# EAGLE design brushed_UAS_Design_2_routed (EAGLE 9.6.2)
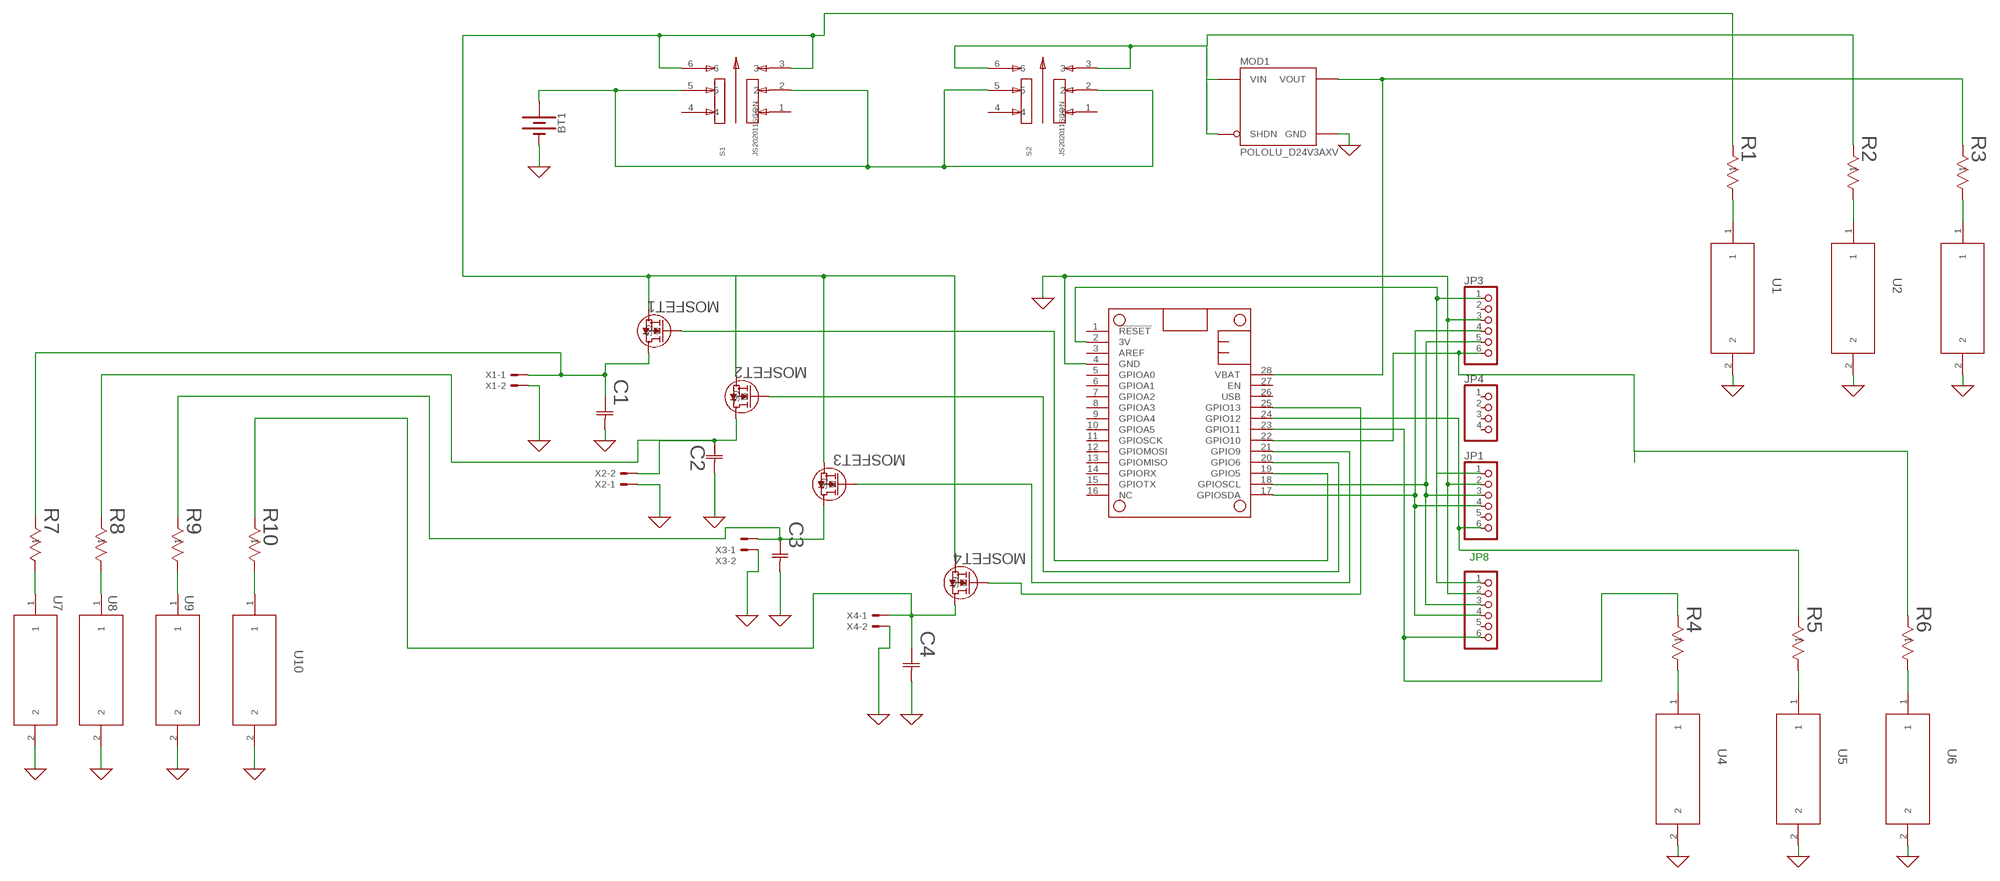
[diagram p0: schematic, sheet 1, part 1 of 2]
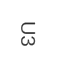
[diagram p1: schematic, sheet 1, part 2 of 2]

## Parts
BT1  BATTERY-18650  [BATTERY_18650-HOLDER]
C1  ECH-U1H102JX5CAP_J1_PAN-M  [CAP_J1_PAN-M]
C2  ECH-U1H102JX5CAP_J1_PAN-M  [CAP_J1_PAN-M]
C3  ECH-U1H102JX5CAP_J1_PAN-M  [CAP_J1_PAN-M]
C4  ECH-U1H102JX5CAP_J1_PAN-M  [CAP_J1_PAN-M]
JP1  HEADER-1X670MIL  [1X06_ROUND_70]
JP3  HEADER-1X676MIL  [1X06_ROUND_76]
JP4  HEADER-1X476MIL  [1X04_ROUND_76]
JP8  HEADER-1X670MIL  [1X06_ROUND_70]
MOD1  POLOLU_D24V3AXV  [POLOLU_D24VXAYV_HC]
MOSFET1  SI2342DS-T1-GE3SOT-23_TO-236_VIS-M  [SOT-23_TO-236_VIS-M]
MOSFET2  SI2342DS-T1-GE3SOT-23_TO-236_VIS-M  [SOT-23_TO-236_VIS-M]
MOSFET3  SI2342DS-T1-GE3SOT-23_TO-236_VIS-M  [SOT-23_TO-236_VIS-M]
MOSFET4  SI2342DS-T1-GE3SOT-23_TO-236_VIS-M  [SOT-23_TO-236_VIS-M]
MS1  FEATHERWING_NODIM  [FEATHERWING_DIM]
R1  CR0805-FX-1000ELFBO_CR0805-M  [BO_CR0805-M]
R2  CR0805-FX-1000ELFBO_CR0805-M  [BO_CR0805-M]
R3  CR0805-FX-1000ELFBO_CR0805-M  [BO_CR0805-M]
R4  CR0805-FX-1000ELFBO_CR0805-M  [BO_CR0805-M]
R5  CR0805-FX-1000ELFBO_CR0805-M  [BO_CR0805-M]
R6  CR0805-FX-1000ELFBO_CR0805-M  [BO_CR0805-M]
R7  CR0805-FX-1000ELFBO_CR0805-M  [BO_CR0805-M]
R8  CR0805-FX-1000ELFBO_CR0805-M  [BO_CR0805-M]
R9  CR0805-FX-1000ELFBO_CR0805-M  [BO_CR0805-M]
R10  CR0805-FX-1000ELFBO_CR0805-M  [BO_CR0805-M]
S1  JS202011SCQN  [SW_JS202011SCQN]
S2  JS202011SCQN  [SW_JS202011SCQN]
U1  L196L-QBCL196L-QBC_AOP-M  [L196L-QBC_AOP-M]
U2  L196L-QBCL196L-QBC_AOP-M  [L196L-QBC_AOP-M]
U3  L196L-QBCL196L-QBC_AOP-M  [L196L-QBC_AOP-M]
U4  L196L-QBCL196L-QBC_AOP-M  [L196L-QBC_AOP-M]
U5  L196L-QBCL196L-QBC_AOP-M  [L196L-QBC_AOP-M]
U6  L196L-QBCL196L-QBC_AOP-M  [L196L-QBC_AOP-M]
U7  L196L-QBCL196L-QBC_AOP-M  [L196L-QBC_AOP-M]
U8  L196L-QBCL196L-QBC_AOP-M  [L196L-QBC_AOP-M]
U9  L196L-QBCL196L-QBC_AOP-M  [L196L-QBC_AOP-M]
U10  L196L-QBCL196L-QBC_AOP-M  [L196L-QBC_AOP-M]
X1  22-23-2021  [22-23-2021]
X2  22-23-2021  [22-23-2021]
X3  22-23-2021  [22-23-2021]
X4  22-23-2021  [22-23-2021]

## Nets
0: BT1.GND@1(-) C1.2 C2.2 C3.2 C4.2 JP1.2 JP3.3 JP8.2 MOD1.G(GND) MS1.4(GND) U1.2 U2.2 U3.2 U4.2 U5.2 U6.2 U7.2 U8.2 U9.2 U10.2 X1.2 X2.1 X3.2 X4.2 ; supply symbol labelled GND
3V: JP1.1 JP3.1 JP8.1 MS1.2(3V)
N$1: BT1.PWR@1(+) S1.2 S1.5 S2.2 S2.5
N$2: MOSFET1.2(S) MOSFET2.2(S) MOSFET3.2(S) MOSFET4.2(S) R1.1 S1.3 S1.6
N$3: R1.2 U1.1
N$4: R2.2 U2.1
N$5: R3.2 U3.1
N$6: MOD1.I(VIN) MOD1.S(SHDN) R2.1 S2.3 S2.6
N$7: MOSFET1.1(G) MS1.19(GPIO5)
N$8: MOSFET2.1(G) MS1.20(GPIO6)
N$9: R4.2 U4.1
N$10: R5.2 U5.1
N$11: R6.2 U6.1
N$12: MOSFET4.1(G) MS1.25(GPIO13)
N$13: MOSFET3.1(G) MS1.21(GPIO9)
N$14: JP1.4 JP3.4 JP8.4 MS1.17(GPIOSDA)
N$15: C4.1 MOSFET4.3(D) R10.1 X4.1
N$16: JP8.6 MS1.23(GPIO11) R4.1
N$17: R10.2 U10.1
N$18: R9.2 U9.1
N$19: R8.2 U8.1
N$20: R7.2 U7.1
N$21: JP1.3 JP3.5 JP8.3 MS1.18(GPIOSCL)
N$22: C3.1 MOSFET3.3(D) R9.1 X3.1
N$23: C1.1 MOSFET1.3(D) R7.1 X1.1
N$24: C2.1 MOSFET2.3(D) R8.1 X2.2
N$25: JP1.6 MS1.24(GPIO12) R5.1
N$26: JP3.6 MS1.22(GPIO10) R6.1
VBAT: MOD1.O(VOUT) MS1.28(VBAT) R3.1
Unconnected: JP1.5 JP3.2 JP4.1 JP4.2 JP4.3 JP4.4 JP8.5 MS1.1(!RESET) MS1.3(AREF) MS1.5(GPIOA0) MS1.6(GPIOA1) MS1.7(GPIOA2) MS1.8(GPIOA3) MS1.9(GPIOA4) MS1.10(GPIOA5) MS1.11(GPIOSCK) MS1.12(GPIOMOSI) MS1.13(GPIOMISO) MS1.14(GPIORX) MS1.15(GPIOTX) MS1.16(NC) MS1.26(USB) MS1.27(EN) S1.1 S1.4 S2.1 S2.4

## Notes on the sheet
- JP8

## Library data of the parts
BT1 = SparkFun-Batteries:BATTERY: Battery - Single Cell A variety of battery chemistries, sizes, and footprints. Device List: 20MM_PTH - Coin Cell Battery Holder - 20mm (PTH) <https://www.sparkfun.com/products/783> 6.8MM_PTH - Coin Cell Battery Holder - 6.8MM(SMD) <https://www.digikey.com/product-detail/en/seiko-instruments/MS621FE-FL11E/728-1057-ND/1889208?WT.srch=1&gclid=CNOQ5a6LzdQCFZS2wAodXCkE0g> 12MM_SMD - Coin Cell Battery Holder - 12mm (SMD) <https://www.sparkfun.com/products/10592> 12MM_PTH - Coin Cell Battery Holder - 12mm (PTH) <https://www.sparkfun.com/products/7948> 20MM_SMD - 20mm Coin Cell Battery Holder (SMD) (2 legs) Used on the Big Time Watch Kit <https://www.sparkfun.com/products/11734> 20MM_SMD_4LEGS - Coin Cell Battery Holder - 20mm (SMD) <https://www.sparkfun.com/products/11892> 20MM_SMD_4LEGS_OVERPASTE - Coin Cell Battery Holder - 20mm (SMD) <https://www.sparkfun.com/products/11892> (Over-paste on the legs) 24.5MM_PTH - Coin Cell Battery Holder - 24.5mm (PTH) <https://www.sparkfun.com/products/8863> 9V - 9V Battery Holder - PC Mount Used on the SparkFun SparkPunk Sound Kit <https://www.sparkfun.com/products/11177> and SparkFun SparkPunk Sequencer Kit <https://www.sparkfun.com/products/12707> 18650 - Battery Holder - 18650 (PTH) <https://www.sparkfun.com/products/13113> AA - Battery Holder - 1xAA (PTH) <https://www.sparkfun.com/products/7949> AAA - Battery Holder - 1xAAA (PTH) <https://www.sparkfun.com/products/12718> AA_KIT - Battery Holder - 1xAA (PTH) <https://www.sparkfun.com/products/7949> Special kit package - pads only have exposed copper on one side of the board. AAA_KIT - Battery Holder - 1xAAA (PTH) <https://www.sparkfun.com/products/12718> Special kit package - pads only have exposed copper on one side of the board.; PROD_ID: BATT-12327; SF_SKU: PRT-13113
C1-C4 = UAS_Capacitor:ECH-U1H102JX5; BUILT_BY: EMA_UL_Team; MANUFACTURER_PART_NUMBER: ECH-U1H102JX5; SOURCELIBRARY: Panasonic_2014-06-20; VENDOR: Panasonic
JP1 JP3 JP8 = microbuilder:HEADER-1X6: PIN HEADER
JP4 = microbuilder:HEADER-1X4: PIN HEADER
MOD1 = _hhn_Pololu:POLOLU_D24V3A*V: Pololu Adjustable Step Down Voltage Regulators Series D24V3A_V (300 mA) 0.4"x0.6" SOURCE www.pololu.com/ PACKAGE THT; 4-pin (0.1"); 0.4"x0.6" TECHNOLOGIES D24V3A…V Vi = (4.5…42)V Vo/V (Vo < Vi) X: (generic) L: (2.5… 7.5) H: (4.0…25.0) Io: 300 mA; Quiescent Current: 2 mA (SHDN: 20 uA) Author: Dipl.-Ing. FH Rainer Bayer
MOSFET1-MOSFET4 = Import1:SI2342DS-T1-GE3; BUILT_BY: EMA_Cory; COPYRIGHT: Copyright (C) 2018 Accelerated Designs. All rights reserved; DATASHEET: http://www.vishay.com/docs/63302/si2342ds.pdf; MANUFACTURER_PART_NUMBER: SI2342DS-T1-GE3; SOURCELIBRARY: Vishay_2020-03-16; VENDOR: Vishay
MS1 = adafruit:FEATHERWING
R1-R10 = 100_Ohm_Resistor:CR0805-FX-1000ELF; BUILT_BY: EMA_UL_Team; MANUFACTURER_PART_NUMBER: CR0805-FX-1000ELF; SOURCELIBRARY: Bourns_2014-12-31; VENDOR: Bourns Electronics
S1 S2 = JS202011SCQN:JS202011SCQN: JS Series DPDT On-On Gull Wing Surface Mount Subminiature Slide Switch; DESCRIPTION: Slide Switch DPDT Surface Mount; DIGI-KEY_PART_NUMBER: 401-2002-1-ND; MF: C&K; MP: JS202011SCQN; PACKAGE: None; PURCHASE-URL: https://pricing.snapeda.com/search/part/JS202011SCQN/?ref=eda
U1-U10 = UAS_LED:L196L-QBC; BUILT_BY: EMA_Colton; COPYRIGHT: Copyright (C) 2018 Accelerated Designs. All rights reserved; DATASHEET: https://www.aopled.com/AOP_PDFs/L196L-QBC.pdf; MANUFACTURER_PART_NUMBER: L196L-QBC; SOURCELIBRARY: Add_to_database_2020-12-29; VENDOR: American Opto Plus
X1-X4 = con-molex:22-23-2021: .100" (2.54mm) Center Header - 2 Pin; MF: MOLEX; MPN: 22-23-2021; OC_FARNELL: 1462926; OC_NEWARK: 25C3832

## Board
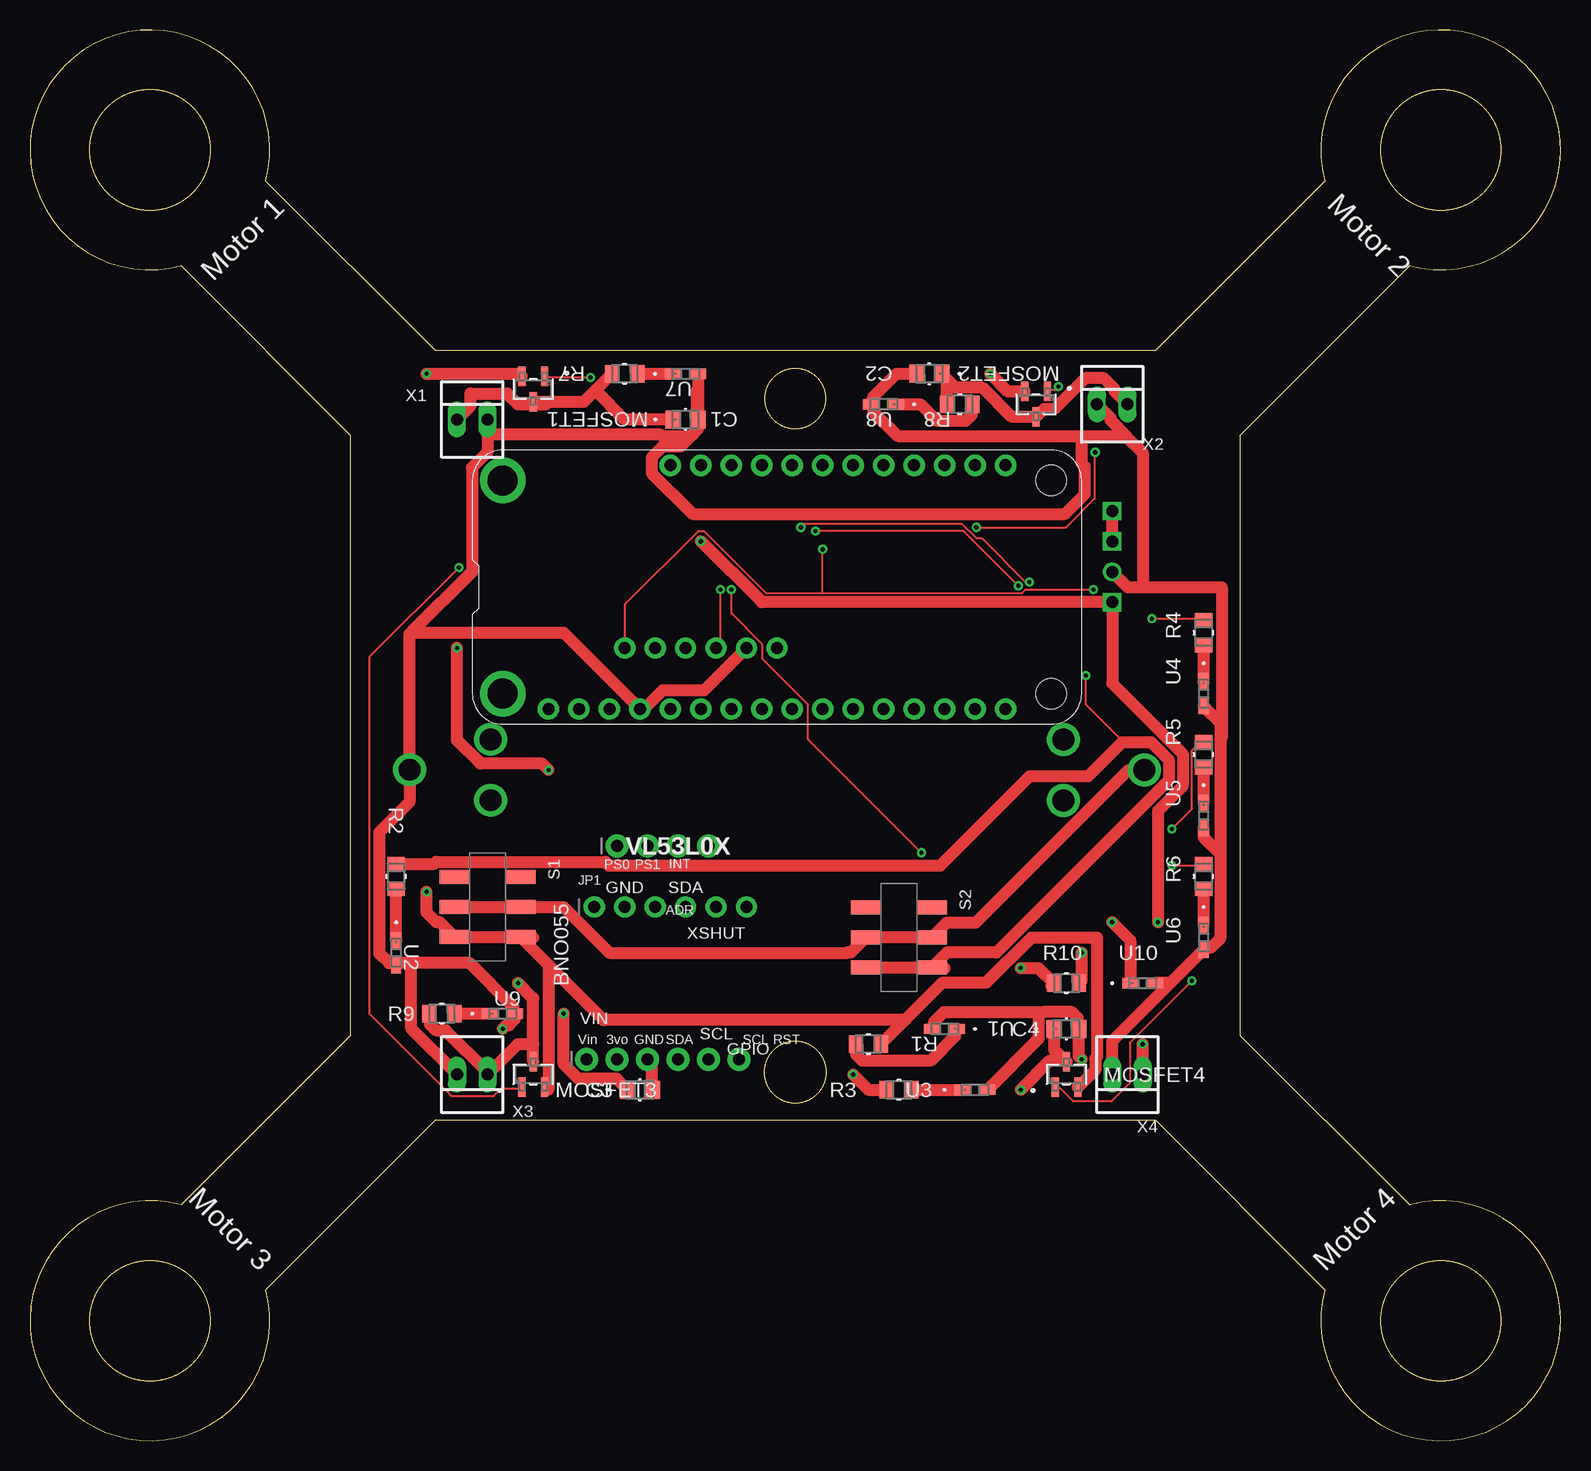
[diagram p2: board, top side]
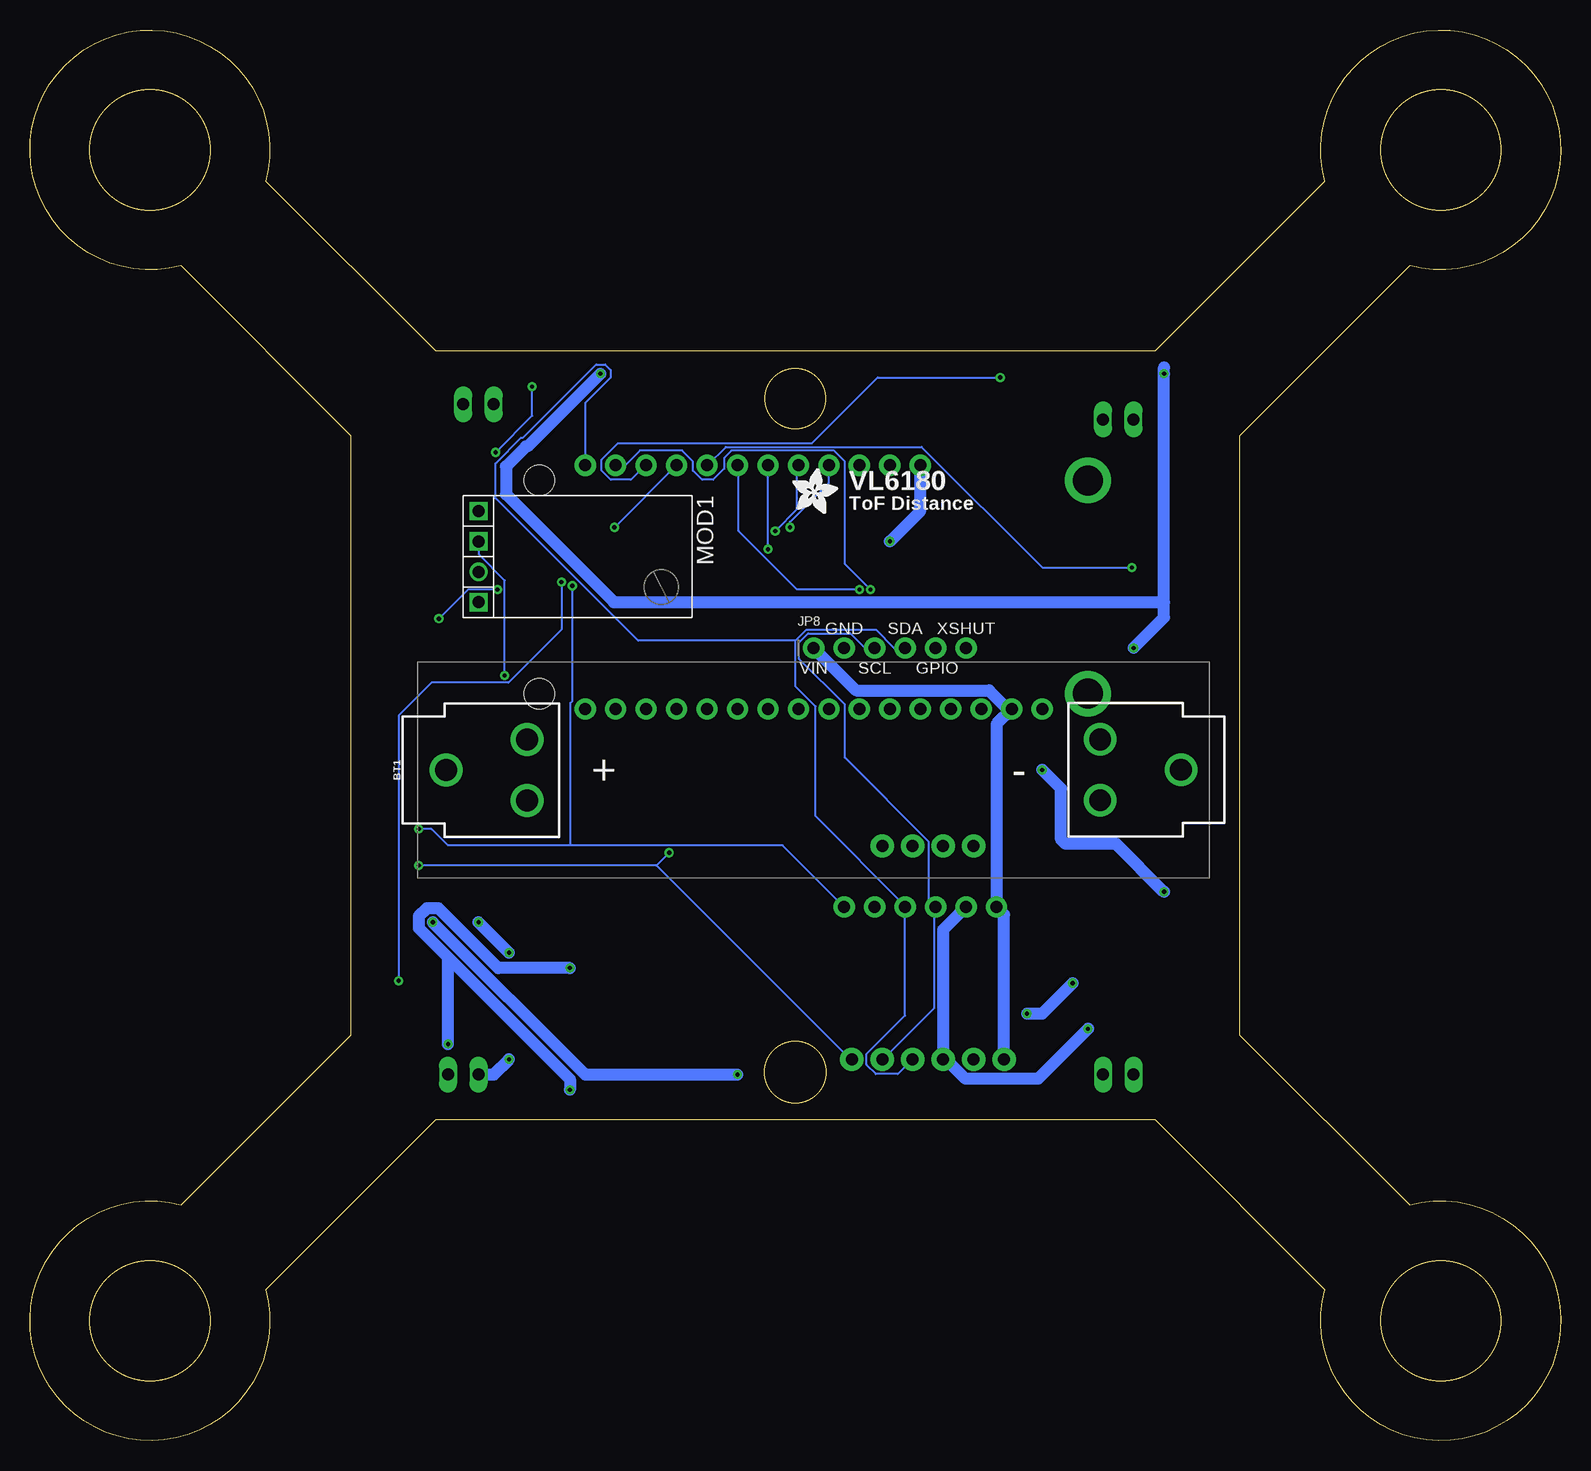
[diagram p3: board, bottom side, seen from below]

Size 127.6 x 117.6 mm. Coordinates in mm from the lower left corner, seen from the top.
Outline: 100.87,83.8 115.01,97.94 arc300 107.94,105.01 93.8,90.87 33.8,90.87 19.66,105.01 arc300 12.59,97.94 26.73,83.8 26.73,33.8 12.59,19.66 arc300 19.66,12.59 33.8,26.73 93.8,26.73 107.94,12.59 arc300 115.01,19.66 100.87,33.8 100.87,83.8
Outline: circle at 117.6,107.6 radius 5
Outline: circle at 117.6,10 radius 5
Outline: circle at 63.8,30.73 radius 2.55
Outline: circle at 10,10 radius 5
Outline: circle at 63.8,86.87 radius 2.5
Outline: circle at 10,107.6 radius 5
Copper layers (1*16): Top 0.035mm / dielectric 1.5mm / Bottom 0.035mm
Design rules "default": minimum track width 6mil, minimum drill 0.35mm, track to track 6mil, track to pad 6mil, pad to pad 6mil, via to via 6mil, smd to smd 6mil, copper to edge 40mil, drill to drill 6mil, minimum pad ring 10mil, minimum via ring 8mil, stop-mask expansion 4mil, vias tented up to drill 0mil, thermal gap 10mil

### Footprints (pad centres in the part's own frame; a part is rotated, then mirrored left to right if it is on the bottom)
BATTERY_18650-HOLDER = drill 1.829: GND@1 30.628,0.01; GND@2 23.88,2.55; GND@3 23.88,-2.53; PWR@1 -30.628,-0.01; PWR@2 -23.88,2.53; PWR@3 -23.88,-2.55
CAP_J1_PAN-M = smd 1.27 x 1.499: 1 -1.029,0; 2 1.029,0
1X06_ROUND_70 = drill 1 pad 1.778: 1 -6.35,0; 2 -3.81,0; 3 -1.27,0; 4 1.27,0; 5 3.81,0; 6 6.35,0
1X06_ROUND_76 = drill 1 pad 1.93: 1 -6.35,0; 2 -3.81,0; 3 -1.27,0; 4 1.27,0; 5 3.81,0; 6 6.35,0
1X04_ROUND_76 = drill 1 pad 1.93: 1 -3.81,0; 2 -1.27,0; 3 1.27,0; 4 3.81,0
POLOLU_D24VXAYV_HC = drill 1: G 1.27,-8.89 | drill 1 square: I -1.27,-8.89; O 3.81,-8.89; S -3.81,-8.89
SOT-23_TO-236_VIS-M = smd 0.61 x 1.626: 1 -0.95,-1.067; 2 0.95,-1.067; 3 0,1.067
FEATHERWING_DIM = drill 1 pad 1.778: 1 6.35,1.27; 2 8.89,1.27; 3 11.43,1.27; 4 13.97,1.27; 5 16.51,1.27; 6 19.05,1.27; 7 21.59,1.27; 8 24.13,1.27; 9 26.67,1.27; 10 29.21,1.27; 11 31.75,1.27; 12 34.29,1.27; 13 36.83,1.27; 14 39.37,1.27; 15 41.91,1.27; 16 44.45,1.27; 17 44.45,21.59; 18 41.91,21.59; 19 39.37,21.59; 20 36.83,21.59; 21 34.29,21.59; 22 31.75,21.59; 23 29.21,21.59; 24 26.67,21.59; 25 24.13,21.59; 26 21.59,21.59; 27 19.05,21.59; 28 16.51,21.59 | drill 2.5 pad 3.81: P$1 2.54,20.32; P$2 2.54,2.54 | hole 2.54: 48.26,20.32; 48.26,2.54
BO_CR0805-M = smd 1.168 x 1.448: 1 -1.054,0; 2 1.054,0
SW_JS202011SCQN = smd 1.2 x 2.5: 1 -2.5,-2.75; 2 0,-2.75; 3 2.5,-2.75; 4 -2.5,2.75; 5 0,2.75; 6 2.5,2.75
L196L-QBC_AOP-M = smd 1.372 x 0.864: 1 -1.023,0; 2 1.023,0
22-23-2021 = drill 1 long: 1 -1.27,0; 2 1.27,0

### Placement (x,y rotation side)
BT1  62.27,55.92 0 bottom
C1  54.65,85.13 0 top
C2  74.97,88.94 180 top
C3  50.84,29.25 0 top
C4  86.4,34.33 0 top
JP1  53.38,44.49 0 top
JP3  52.75,31.79 0 top
JP4  52.75,49.57 0 top
JP8  55.92,66.08 0 bottom
MOD1  81.32,73.7 270 bottom
MOSFET1  41.95,87.67 180 top
MOSFET2  83.86,86.4 180 top
MOSFET3  41.95,30.52 0 top
MOSFET4  86.4,30.52 0 top
MS1  36.87,59.73 0 top
R1  69.89,33.06 180 top
R2  30.52,47.03 270 top
R3  72.43,29.25 0 top
R4  97.83,67.35 270 top
R5  97.83,57.19 270 top
R6  97.83,47.03 270 top
R7  49.57,88.94 0 top
R8  77.51,86.4 0 top
R9  34.33,35.6 0 top
R10  86.4,38.14 0 top
S1  38.14,44.49 270 top
S2  72.43,41.95 270 top
U1  76.24,34.33 180 top
U2  30.52,40.68 270 top
U3  78.78,29.25 0 top
U4  97.83,62.27 270 top
U5  97.83,52.11 270 top
U6  97.83,41.95 270 top
U7  54.65,88.94 0 top
U8  71.16,86.4 180 top
U9  39.41,35.6 0 top
U10  92.75,38.14 0 top
U$19  [ADAFRUIT_3.5MM]  64.05,77.26 0 bottom
X1  36.87,85.13 0 top
X2  90.21,86.4 0 top
X3  36.87,30.52 180 top
X4  91.48,30.52 180 top

### Tracks (layer width: path | path; a pad name or v marks a point on that pad's centre or on a via)
0  (via drill 0.35)
  Top 1.016: U2.2 30.37,39.81 | 30.37,39.81 29.92,39.81 29.14,40.6 29.14,50.73 31.64,53.23 BT1.GND@1 31.64,67.2 31.79,67.35 | C3.2 51.87,31.4 JP3.3 | 31.79,39.81 36.67,39.81 40.28,36.2 40.28,35.75 U9.2 40.43,35.16 39.94,34.66 39.74,34.66 v39.41,34.33 | 31.79,39.81 30.37,39.81 | X3.2 31.79,34.33 31.79,39.81 | 84.46,35.74 84.08,35.35 84.08,33.52 U3.2 | 84.46,35.74 86.83,35.74 87.33,35.25 87.33,34.43 C4.2 87.43,32.03 v87.67,31.79 | U1.2 75.37,34.48 75.37,34.93 76.18,35.74 84.46,35.74 | 95.04,38.14 U6.2 97.98,41.08 98.43,41.08 99.22,41.87 99.22,48.94 | 95.04,38.14 U10.2 | U5.2 97.83,50.33 99.22,48.94 | U4.2 99.22,59.86 99.22,58.46 | 99.22,58.46 99.22,48.94 | MOD1.G 91.48,71.16 92.75,71.16 | 92.75,71.16 99.35,71.16 99.35,58.59 99.22,58.46 | 31.79,67.35 44.49,67.35 MS1.4 51.19,61 52.74,62.55 56.2,62.55 JP8.2 | X1.2 38.14,83.86 | 38.14,83.86 38.14,82.41 36.85,81.11 36.85,72.41 31.79,67.35 | U7.2 55.68,87.67 | 55.68,87.67 C1.2 55.68,84.32 54.23,82.87 52.74,82.87 51.83,81.96 51.83,80.68 55.25,77.26 86.29,77.26 87.93,78.89 87.93,81.21 87.67,81.46 87.67,83.75 | 55.68,87.67 55.58,87.57 55.58,84.22 55.08,83.72 52.71,83.72 52.57,83.86 38.14,83.86 | X2.1 90.07,85.28 90.07,85.06 91.37,83.75 | 92.75,71.16 92.75,82.38 91.37,83.75 | C2.2 72.23,88.94 70.29,87 70.29,86.55 U8.2 70.29,86.25 70.29,85.8 72.34,83.75 87.67,83.75 | 87.67,83.75 91.37,83.75 | X4.2 90.21,33.31 95.04,38.14
  Bottom 1.016: JP1.2 51.48,42.59 JP3.3 51.24,31.79 49.61,30.17 43.58,30.17 v39.41,34.33 | X4.2 88.94,30.52 v87.67,31.79
3V
  Bottom 1.016: JP8.1 58.74,62.55 47.66,62.55 46.11,61 MS1.2 47.03,59.73 JP1.1 46.4,43.86 JP3.1
N$1
  Top 0.152: S1.5 40.94,44.44 40.94,44.49
  Top 1.016: S1.2 S1.5 40.94,44.49 44.49,44.49 48.3,40.68 68.13,40.68 68.16,40.71 68.44,40.71 S2.2 S2.5 76.42,43.19 78.84,43.19 91.57,55.91 BT1.PWR@1
N$2  (via drill 0.35)
  Top 0.152: MOSFET3.2 42.92,29.51 43.22,29.51
  Top 1.016: S1.6 S1.3 34.15,43.23 33.87,43.23 33.06,44.04 v33.06,45.76 | S1.6 41.91,41.99 41.95,41.95 40.93,41.95 S1.6 | S1.6 43.22,39.66 | 43.22,39.66 43.22,29.51 43.22,29.25 | R1.1 72.96,35.07 | 72.96,35.07 76.08,38.19 79.71,38.19 83.47,41.95 88.94,41.95 88.94,32.01 88.8,31.86 88.8,30.9 MOSFET4.2 | 72.96,35.07 47.81,35.07 43.22,39.66 | v43.22,55.92 42.7,56.44 37.55,56.44 35.6,58.39 v35.6,66.08 | v33.06,88.94 40.8,88.94 MOSFET1.2 | MOSFET2.2 81.52,87.47 v80.05,88.94
  Bottom 1.016: v33.06,45.76 37.05,49.75 41.28,49.75 41.65,50.12 41.65,54.35 v43.22,55.92 | v35.6,66.08 33.06,68.62 33.06,69.89 | 33.06,69.89 v33.06,88.94 33.06,89.45 | 33.06,69.89 78.92,69.89 87.93,78.89 87.93,81.21 86.26,82.87 86.12,82.87 v80.05,88.94
N$3
  Top 1.016: U1.1 77.11,34.18 77.11,33.73 75.06,31.68 69.38,31.68 68.89,32.17 68.89,33.01 R1.2
N$4
  Top 1.016: U2.1 R2.2
N$5
  Top 1.016: R3.2 U3.1
N$6  (via drill 0.35)
  Top 0.152: v88.03,63.8 88.03,61.36 90.77,58.61 91.05,58.23 | 74.77,39.45 74.77,39.56 S2.6
  Top 1.016: R2.1 33.7,48.09 33.87,48.25 47.96,48.25 48.26,47.95 75.89,47.95 83.35,55.4 88.22,55.4 91.05,58.23 93.45,58.23 94.93,56.75 94.93,55.07 80.55,40.69 76.42,40.69 S2.6 | S2.3 74.77,39.45 S2.6 | S2.6 76.2,39.45 76.24,39.41 | MOD1.I MOD1.S
  Bottom 0.152: v88.03,63.8 88.03,71.72 90.16,73.85 90.16,74.92 MOD1.I
N$7  (via drill 0.35)
  Top 0.152: v46.73,88.64 42.92,88.64 MOSFET1.1
  Bottom 0.152: v46.73,88.64 56.94,88.64 62.42,83.15 78.58,83.15 79.95,81.78 79.95,80.86 79.19,80.1 77.51,80.1 76.29,81.32 MS1.19
N$8  (via drill 0.35)
  Top 0.152: v85.74,87.87 85.44,87.57 84.83,87.57 MOSFET2.1 | v88.79,82.39 88.79,78.58 86.35,76.14 v78.88,76.14
  Bottom 0.152: v85.74,87.87 85.74,85.44 v88.79,82.39 | MS1.20 v78.88,76.14
N$9
  Top 1.016: R4.2 U4.1 97.83,63.14
N$10
  Top 1.016: R5.2 U5.1
N$11
  Top 1.016: R6.2 U6.1
N$12  (via drill 0.35)
  Top 0.152: v96.87,38.34 91.68,33.16 91.68,29.81 90.16,28.29 86.96,28.29 85.89,29.35 85.59,29.35 MOSFET4.1 | v83.3,71.57 83,71.57 79.34,75.23 78.88,75.23 77.66,76.44 64.56,76.44 v64.25,76.14
  Bottom 0.152: v96.87,38.34 96.87,60.44 94.12,63.19 87.72,63.19 83.3,67.61 v83.3,71.57 | v64.25,76.14 64.25,76.6 61.05,79.8 61.05,81.32 MS1.25
N$13  (via drill 0.35)
  Top 0.152: v35.75,72.79 28.29,65.32 28.29,35.6 35.14,28.74 38.65,28.74 39.26,29.35 40.94,29.35 MOSFET3.1
  Bottom 0.152: v35.75,72.79 43.22,72.79 53.28,82.85 69.59,82.85 71.11,81.32 MS1.21
N$14
  Bottom 0.152: JP3.4 54.04,31.79 55.26,30.57 57.09,30.57 57.85,31.33 57.85,32.25 54.65,35.45 JP1.4 54.65,44.59 62.12,52.06 62.12,61.2 63.8,62.88 63.8,66.69 | JP8.4 55.57,66.08 57.09,67.61 62.88,67.61 63.8,66.69 | MS1.17 81.32,86.5 79.19,88.64 79.19,89.25 79.65,89.7 80.41,89.7 86.5,83.61 86.66,83.61 88.79,81.47 88.79,78.58 76.9,66.69 63.8,66.69
N$15  (via drill 0.35)
  Top 1.016: 85.13,37.93 R10.1 84.08,39.41 v82.59,39.41 | 85.35,34.31 C4.1 85.37,32.62 86.3,31.69 | 86.3,31.69 MOSFET4.3 | X4.1 v92.75,33.06 | v82.59,29.25 85.03,31.69 86.3,31.69
  Bottom 1.016: v92.75,33.06 92.75,40.3 | 92.75,40.3 95.19,42.74 95.19,43.71 94.51,44.39 93.54,44.39 88.56,39.41 v82.59,39.41 | 92.75,40.3 82.59,30.14 v82.59,29.25
N$16  (via drill 0.35)
  Top 0.152: v93.51,68.52 97.78,68.52 R4.1 | v88.64,70.96 83,70.96 82.69,70.65 66.08,70.65 | 66.08,70.65 61.36,70.65 56.18,75.84 55.72,75.84 49.62,69.74 49.62,66.08 JP8.6 | 66.08,70.65 v66.08,74.31
  Bottom 0.152: v93.51,68.52 91.08,70.96 v88.64,70.96 | v66.08,74.31 MS1.23
N$17  (via drill 0.35)
  Top 1.016: R10.2 87.67,38.36 v87.67,40.68 | v90.21,43.22 91.73,41.7 U10.1
  Bottom 1.016: v87.67,40.68 v90.21,43.22
N$18
  Top 1.016: R9.2 U9.1
N$19
  Top 1.016: U8.1 74.22,86.4 75.6,85.02 78.02,85.02 78.51,85.51 78.51,86.35 R8.2
N$20
  Top 1.016: R7.2 U7.1
N$21  (via drill 0.35)
  Top 0.152: v57.55,70.96 57.55,66.39 57.24,66.08 JP8.3
  Bottom 0.152: JP3.5 56.48,31.79 52.21,36.06 52.21,44.44 JP1.3 52.67,45.05 52.67,49.93 59.68,56.94 59.68,61.36 63.49,65.17 63.49,66.54 62.73,67.3 59.22,67.3 58,66.08 JP8.3 | MS1.18 77.97,81.32 76.75,82.54 73.24,82.54 72.33,81.63 72.33,80.86 71.57,80.1 70.65,80.1 69.74,81.02 69.74,81.93 69.13,82.54 60.6,82.54 59.68,81.63 59.68,73.09 v57.55,70.96
N$22  (via drill 0.35)
  Top 1.016: C3.1 48.9,30.17 45.72,30.17 44.49,31.4 v44.49,35.6 | MOSFET3.3 41.95,33.06 | 41.95,33.06 41.95,36.87 v40.68,38.14 | R9.1 33.33,35.55 33.33,34.71 33.82,34.22 34.66,34.22 38.14,30.74 X3.1 40.68,33.06 41.95,33.06
  Bottom 1.016: v44.49,35.6 43.22,35.6 v40.68,38.14
N$23
  Top 1.016: MOSFET1.3 43.22,86.6 | 43.22,86.6 46.18,86.6 47.14,87.56 | 47.14,87.56 R7.1 | C1.1 49.57,85.13 47.14,87.56 | X1.1 36.73,86.26 36.73,87.3 39.78,87.3 40.68,86.4 43.02,86.4 43.22,86.6
N$24
  Top 1.016: R8.1 76.46,88.48 C2.1 77.16,87.79 79.42,87.79 81.87,85.33 MOSFET2.3 84.52,86 85.39,86 87.96,88.57 89.53,88.57 90.36,87.74 90.36,87.53 X2.2
N$25  (via drill 0.35)
  Top 0.152: v95.19,50.99 96.87,52.67 96.87,57.55 97.48,58.16 97.78,58.16 R5.1 | v65.47,75.84 77.82,75.84 v82.39,71.26
  Bottom 0.152: v95.19,50.99 94.12,50.99 92.75,49.62 82.54,49.62 | 82.54,49.62 64.86,49.62 JP1.6 | v65.47,75.84 63.64,77.66 63.64,81.32 MS1.24 | v82.39,71.26 82.39,61.66 82.54,61.51 82.54,49.62
N$26  (via drill 0.35)
  Top 0.152: v95.19,47.95 97.78,47.95 R6.1 | v58.46,70.96 58.46,68.98 61.05,66.39 61.05,65.17 64.86,61.36 64.86,58.46 v74.31,49.01
  Bottom 0.152: 75.38,47.95 v95.19,47.95 | 75.38,47.95 59.22,31.79 JP3.6 | v58.46,70.96 63.64,70.96 68.52,75.84 68.52,81.32 MS1.22 | 75.38,47.95 v74.31,49.01
VBAT  (via drill 0.35)
  Top 1.016: v55.92,74.97 61,69.89 MOD1.O 90.21,63.13 96.1,57.24 96.1,54.59 94.02,52.51 v94.02,43.22 | v68.62,30.52 69.89,29.25 R3.1
  Bottom 1.016: v55.92,74.97 53.38,77.51 MS1.28 | v94.02,43.22 81.32,30.52 v68.62,30.52

### Text on the board
tPlace: VL53L0X | PS0 | PS1 | INT | GND | SDA | ADR | XSHUT | BNO055 | VIN | Vin | 3vo | GND | SDA | SCL | SCL | RST | GPIO
bPlace: VL6180 | ToF Distance | XSHUT | SDA | GND | GPIO | SCL | VIN
tNames: Motor 2 | Motor 1 | Motor 3 | Motor 4